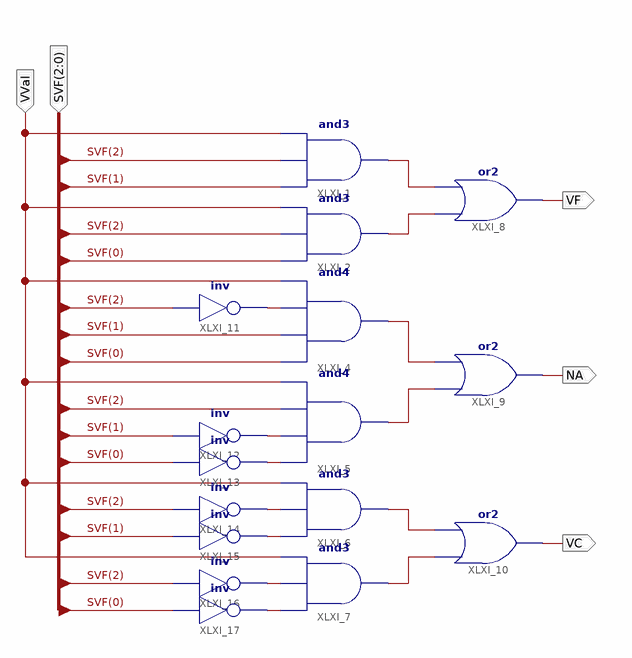
[diagram p0: schematic sheet 1]
// Xilinx ISE schematic Resultado_Votacion.sch (spartan6) as structural Verilog: 16 symbols, 5 ports
module Resultado_Votacion (
  input  [2:0] SVF,
  input  VVal,
  output VF,
  output NA,
  output VC
);

  wire XLXN_6, XLXN_7, XLXN_8, XLXN_9, XLXN_10, XLXN_11, XLXN_12, XLXN_13, XLXN_14, XLXN_15, XLXN_16,
       XLXN_17, XLXN_18;

  and XLXI_1 (XLXN_13, SVF[1], SVF[2], VVal);
  and XLXI_2 (XLXN_14, SVF[0], SVF[2], VVal);
  and XLXI_4 (XLXN_15, SVF[0], SVF[1], XLXN_12, VVal);
  and XLXI_5 (XLXN_16, XLXN_10, XLXN_11, SVF[2], VVal);
  and XLXI_6 (XLXN_17, XLXN_8, XLXN_9, VVal);
  and XLXI_7 (XLXN_18, XLXN_6, XLXN_7, VVal);
  or XLXI_8 (VF, XLXN_14, XLXN_13);
  or XLXI_9 (NA, XLXN_16, XLXN_15);
  or XLXI_10 (VC, XLXN_18, XLXN_17);
  not XLXI_11 (XLXN_12, SVF[2]);
  not XLXI_12 (XLXN_11, SVF[1]);
  not XLXI_13 (XLXN_10, SVF[0]);
  not XLXI_14 (XLXN_9, SVF[2]);
  not XLXI_15 (XLXN_8, SVF[1]);
  not XLXI_16 (XLXN_7, SVF[2]);
  not XLXI_17 (XLXN_6, SVF[0]);
endmodule
